# Altium schematic sheet MKE1xFxxxVLH.SchDoc
size A
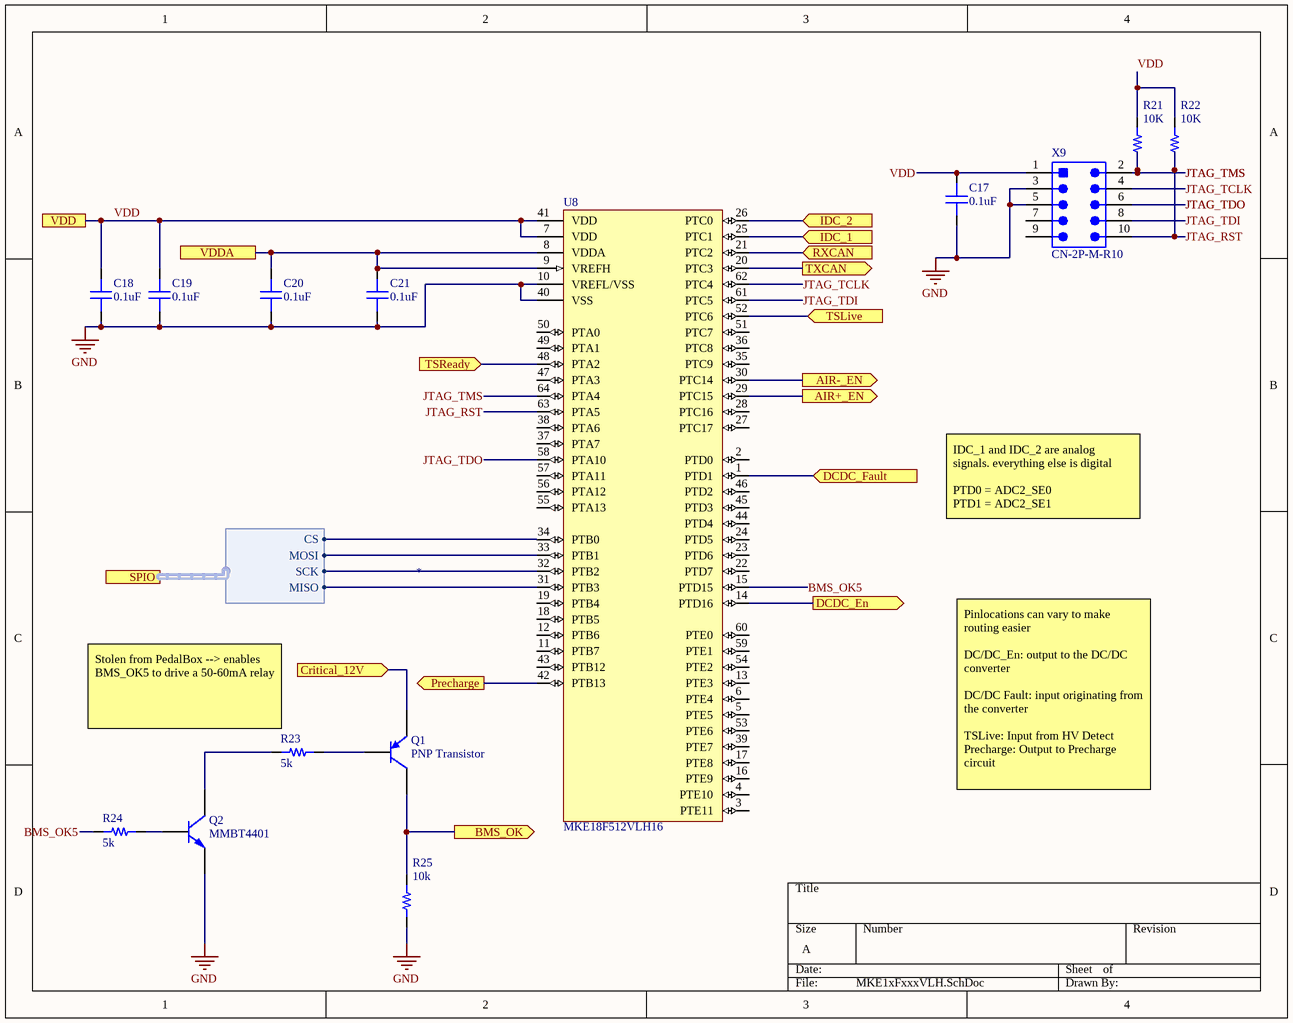
[diagram p0: MKE1xFxxxVLH.SchDoc]

## Parts
C17  capacitance: 0.1uF  [0603]  (hidden comment: capacitor)
C18  capacitance: 0.1uF  [0603]  (hidden comment: capacitor)
C19  capacitance: 0.1uF  [0603]  (hidden comment: capacitor)
C20  capacitance: 0.1uF  [0603]  (hidden comment: capacitor)
C21  capacitance: 0.1uF  [0603]  (hidden comment: capacitor)
Q1  PNP Transistor  [SOT23-3]
Q2  MMBT4401  [SOT23-3]
R21  10K  [RES 0603/1608]
R22  10K  [RES 0603/1608]
R23  5k  [RES 0603/1608]
R24  5k  [RES 0603/1608]
R25  10k  [RES 0603/1608]
U8  MKE18F512VLH16  [TQFP64]
X9  CN-2P-M-R10  [HDR2X5_SMT]

## Ports
AIR+_EN (out), AIR-_EN (out), BMS_OK (out), Critical_12V (in), DCDC_En (out), DCDC_Fault (in), IDC_1 (in), IDC_2 (in), Precharge (out), RXCAN (in), SPIO (harness *), TSLive (in), TSReady (in), TXCAN (out), VDD, VDDA

## Harnesses
*: CS, MOSI, SCK, MISO

## Nets
GND: C17.1 C18.1 C19.1 C20.1 C21.1 Q2.2(E) R25.1 U8.10(VREFL/VSS) U8.40(VSS) X9.3 X9.5
AIR+_EN: U8.29(PTC15) ; port AIR+_EN
AIR-_EN: U8.30(PTC14) ; port AIR-_EN
BMS_OK: Q1.3(C) R25.2 ; port BMS_OK
BMS_OK5: R24.2 U8.15(PTD15)
Critical_12V: Q1.2(E) ; port Critical_12V
DCDC_En: U8.14(PTD16) ; port DCDC_En
DCDC_Fault: U8.1(PTD1) ; port DCDC_Fault
IDC_1: U8.25(PTC1) ; port IDC_1
IDC_2: U8.26(PTC0) ; port IDC_2
JTAG_RST: R22.1 U8.63(PTA5) X9.10
JTAG_TCLK: U8.62(PTC4) X9.4
JTAG_TDI: U8.61(PTC5) X9.8
JTAG_TDO: U8.58(PTA10) X9.6
JTAG_TMS: R21.1 U8.64(PTA4) X9.2
Precharge: U8.42(PTB13) ; port Precharge
RXCAN: U8.21(PTC2) ; port RXCAN
TSLive: U8.52(PTC6) ; port TSLive
TSReady: U8.48(PTA2) ; port TSReady
TXCAN: U8.20(PTC3) ; port TXCAN
VDD: C17.2 C18.2 C19.2 R21.2 R22.2 U8.7(VDD) U8.41(VDD) X9.1 ; port VDD
VDDA: C20.2 C21.2 U8.8(VDDA) U8.9(VREFH) ; port VDDA
NetQ1_1: Q1.1(B) R23.1
NetQ2_1: Q2.1(B) R24.1
NetQ2_3: Q2.3(C) R23.2
NetU8_31: U8.31(PTB3) ; port SPIO.MISO
NetU8_32: U8.32(PTB2) ; port SPIO.SCK
NetU8_33: U8.33(PTB1) ; port SPIO.MOSI
NetU8_34: U8.34(PTB0) ; port SPIO.CS

Not connected (* = marked no-connect by the designer): U8 2(PTD0) 3(PTE11) 4(PTE10) 5(PTE5) 6(PTE4) 11(PTB7) 12(PTB6) 13(PTE3) 16(PTE9) 17(PTE8) 18(PTB5) 19(PTB4) 22(PTD7) 23(PTD6) 24(PTD5) 27(PTC17) 28(PTC16) 35(PTC9) 36(PTC8) 37(PTA7) 38(PTA6) 39(PTE7) 43(PTB12) 44(PTD4) 45(PTD3) 46(PTD2) 47(PTA3) 49(PTA1) 50(PTA0) 51(PTC7) 53(PTE6) 54(PTE2) 55(PTA13) 56(PTA12) 57(PTA11) 59(PTE1) 60(PTE0); X9 7 9

## Notes on the sheet
- IDC_1 and IDC_2 are analog signals. everything else is digital
  PTD0 = ADC2_SE0
  PTD1 = ADC2_SE1
- (near R23) Stolen from PedalBox --> enables BMS_OK5 to drive a 50-60mA relay
- Pinlocations can vary to make routing easier
  DC/DC_En: output to the DC/DC converter
  DC/DC Fault: input originating from the converter
  TSLive: Input from HV Detect
  Precharge: Output to Precharge circuit

## Library data of the parts
C17-C21 = 1: Generic 0603 capacitor; id: 1; voltage: 50; dielectric: Ceramic; percent tolerance: 10; name: 0603 Capacitor; ESR: 1; package: 0603; quantity: 0
Q1 = 13: Bipolar (BJT) Transistor PNP 25V 1.5A 100MHz; id: 13; name: MMSS8550-L-TP; power: 625; vcemax: 25; type: PNP; package: SOT23-3; quantity: 0; link: https://www.digikey.com/product-detail/en/micro-commercial-co/MMSS8550-L-TP/MMSS8550-L-TPMSCT-ND/2827205; createdby: Kevin; createddate: 10/16/2019 7:23:00 AM
Q2 = 2: id: 2; type: NPN; name: MMBT4401; package: SOT23-3; quantity: 0; link: https://www.digikey.com/product-detail/en/diodes-incorporated/MMBT4401-7-F/MMBT4401-FDICT-ND/775867
R21-R25 = 1: id: 1; name: 0603 Resistor; percent tolerance: 5; package: 0603; quantity: 0
  R21 R22: resistance: 10K
  R23 R24: resistance: 5k
  R25: resistance: 10k
U8 = 1: 32b NXP Microcontroller; id: 1; Vcc: 2.7-5.5; Name: MKE18F512VLH16; package: TQFP64; quantity: 0
X9 = 4: CONN_TE_2X5POS; id: 4; name: 5103309-1; numcontacts: 10; numrows: 2; pitch: 2.54mm; MfrPartNo: *; link: https://www.digikey.com/product-detail/en/5103309-1/A33160-ND/1114898?utm_campaign=buynow&WT.z_cid=ref_octopart_dkc_buynow&utm_medium=aggregator&curr=usd&site=us&utm_source=octopart; quantity: 0